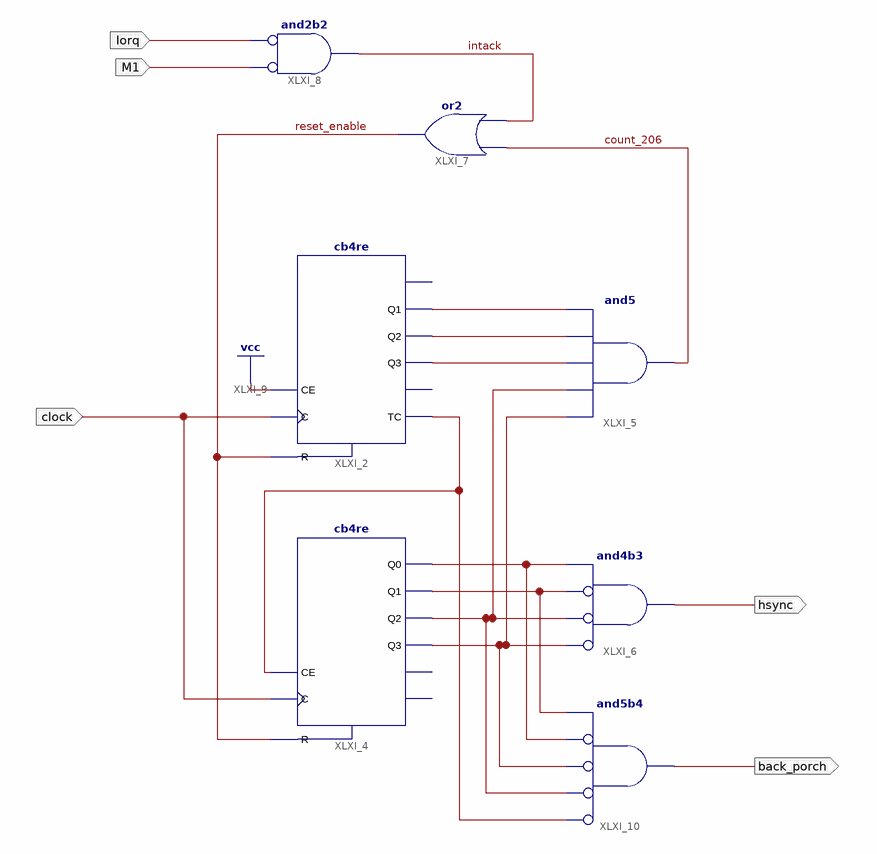
[diagram p0: schematic sheet 1]
// Xilinx ISE schematic hsync_gen.sch (xc9500) as structural Verilog: 7 symbols, 5 ports
module hsync_gen (
  input  clock,
  input  Iorq,
  input  M1,
  output hsync,
  output back_porch
);

  wire count_206, intack, q1, q2, q3, q4, q5, q6, q7, reset_enable, XLXN_7;

  cb4re XLXI_2 (.C(clock), .CE(1'b1), .R(reset_enable), .Q1(q1), .Q2(q2), .Q3(q3), .TC(XLXN_7));  // open: CEO, Q0
  cb4re XLXI_4 (.C(clock), .CE(XLXN_7), .R(reset_enable), .Q0(q4), .Q1(q5), .Q2(q6), .Q3(q7));  // open: CEO, TC
  and XLXI_5 (count_206, q7, q6, q3, q2, q1);
  and XLXI_6 (hsync, ~q7, ~q6, ~q5, q4);  // and4b3
  or XLXI_7 (reset_enable, intack, count_206);
  and XLXI_8 (intack, ~M1, ~Iorq);  // and2b2
  and XLXI_10 (back_porch, ~XLXN_7, ~q6, ~q7, ~q4, q5);  // and5b4
endmodule
